# Altium schematic sheet POWER.SchDoc
size A3
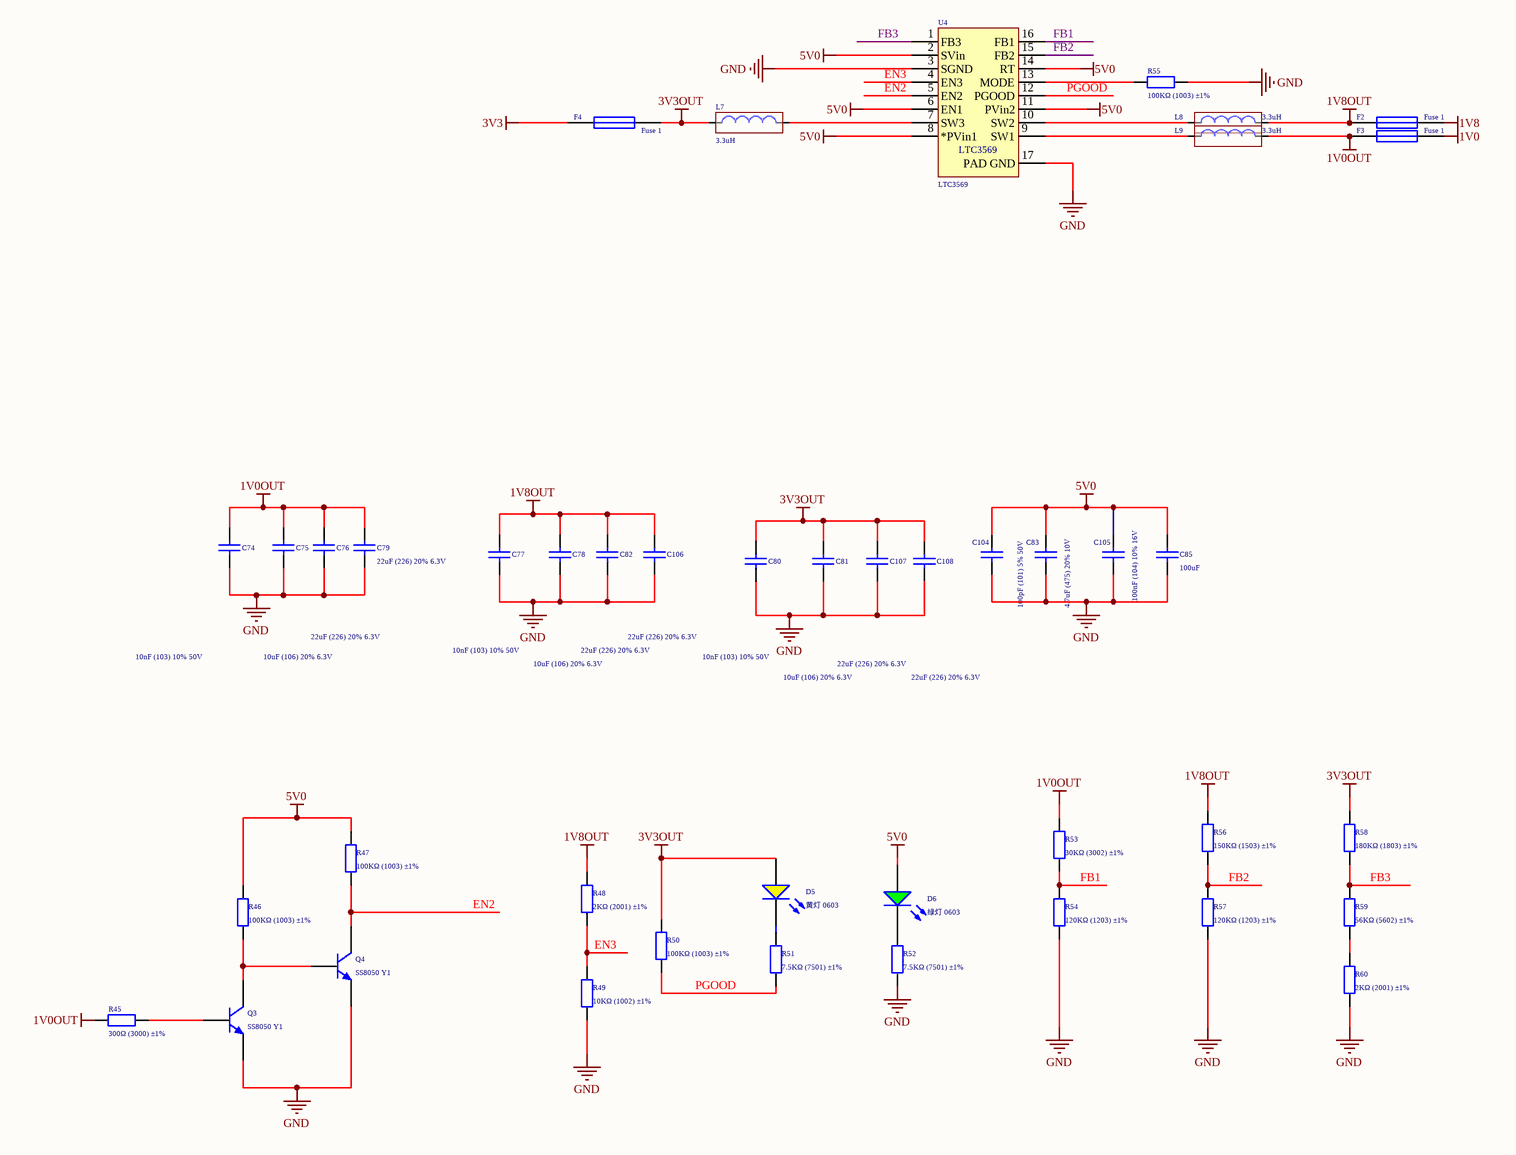
[diagram p0: POWER.SchDoc]

## Parts
C74  10nF (103) 10% 50V  [0402_C]
C75  10uF (106) 20% 6.3V  [0402_C]
C76  22uF (226) 20% 6.3V  [0603_C]
C77  10nF (103) 10% 50V  [0402_C]
C78  10uF (106) 20% 6.3V  [0402_C]
C79  22uF (226) 20% 6.3V  [0603_C]
C80  10nF (103) 10% 50V  [0402_C]
C81  10uF (106) 20% 6.3V  [0402_C]
C82  22uF (226) 20% 6.3V  [0603_C]
C83  4.7uF (475) 20% 10V  [0402_C]
C85  value 100uF  [LC-1206]  (hidden comment: Cap)
C104  100pF (101) 5% 50V  [0402_C]
C105  100nF (104) 10% 16V  [0402_C]
C106  22uF (226) 20% 6.3V  [0603_C]
C107  22uF (226) 20% 6.3V  [0603_C]
C108  22uF (226) 20% 6.3V  [0603_C]
D5  黄灯 0603  [0603_LED_S1]
D6  绿灯 0603  [0603_LED_S1]
F2  Fuse 1  [1206]
F3  Fuse 1  [1206]
F4  Fuse 1  [1206]
L7  3.3uH  [LC-1210]
L8  3.3uH  [LC-1210]
L9  3.3uH  [LC-1210]
Q3  SS8050 Y1  [SOT-23(SOT-23-3)]
Q4  SS8050 Y1  [SOT-23(SOT-23-3)]
R45  300Ω (3000) ±1%  [0402_R]
R46  100KΩ (1003) ±1%  [0402_R]
R47  100KΩ (1003) ±1%  [0402_R]
R48  2KΩ (2001) ±1%  [0402_R]
R49  10KΩ (1002) ±1%  [0402_R]
R50  100KΩ (1003) ±1%  [0402_R]
R51  7.5KΩ (7501) ±1%  [0402_R]
R52  7.5KΩ (7501) ±1%  [0402_R]
R53  30KΩ (3002) ±1%  [0603_R]
R54  120KΩ (1203) ±1%  [0402_R]
R55  100KΩ (1003) ±1%  [0402_R]
R56  150KΩ (1503) ±1%  [0402_R]
R57  120KΩ (1203) ±1%  [0402_R]
R58  180KΩ (1803) ±1%  [0603_R]
R59  56KΩ (5602) ±1%  [0402_R]
R60  2KΩ (2001) ±1%  [0402_R]
U4  LTC3569  [SOP127P600-16N]

## Nets
1V0: F3.1
1V0OUT: C74.2 C75.2 C76.2 C79.2 F3.2 L9.2 R45.1 R53.2
1V8: F2.1
1V8OUT: C77.2 C78.2 C82.2 C106.2 F2.2 L8.2 R48.2 R56.2
3V3: F4.2
3V3OUT: C80.2 C81.2 C107.2 C108.2 D5.A F4.1 L7.1 R50.2 R58.2
5V0: C83.1 C85.2 C104.2 C105.2 D6.A R46.2 R47.2 U4.2(SVin) U4.6(EN1) U4.8(*PVin1) U4.11(PVin2) U4.14(RT)
GND: C74.1 C75.1 C76.1 C77.1 C78.1 C79.1 C80.1 C81.1 C82.1 C83.2 C85.1 C104.1 C105.1 C106.1 C107.1 C108.1 Q3.2(E) Q4.2(E) R49.1 R52.1 R54.1 R55.2 R57.1 R60.1 U4.3(SGND) U4.17(PAD_GND)
EN2: Q4.3(C) R47.1 U4.5(EN2)
EN3: R48.1 R49.2 U4.4(EN3)
FB1: R53.1 R54.2 U4.16(FB1)
FB2: R56.1 R57.2 U4.15(FB2)
FB3: R58.1 R59.2 U4.1(FB3)
PGOOD: R50.1 R51.1 U4.12(PGOOD)
NetD5_K: D5.K R51.2
NetD6_K: D6.K R52.2
NetL7_2: L7.2 U4.7(SW3)
NetL8_1: L8.1 U4.10(SW2)
NetL9_1: L9.1 U4.9(SW1)
NetQ3_1: Q3.1(B) R45.2
NetQ3_3: Q3.3(C) Q4.1(B) R46.1
NetR55_1: R55.1 U4.13(MODE)
NetR59_1: R59.1 R60.2

## Library data of the parts
C74 C77 C80 = 0402 10nF (103) 10% 50V: 贴片电容; ComponentLink1Description: 供应商链接; ComponentLink1URL: http://www.szlcsc.com/product/details_15869.html; Package: 0402; Supplier: LC; SuppliersPartNumber: C15195
C75 C78 C81 = 0402 10uF (106) 20% 6.3V: 贴片电容; ComponentLink1Description: 供应商链接; ComponentLink1URL: http://www.szlcsc.com/product/details_16204.html; Package: 0402; Supplier: LC; SuppliersPartNumber: C15525
C76 C79 C82 C106-C108 = 0603 22uF (226) 20% 6.3V: 贴片电容; ComponentLink1Description: 供应商链接; ComponentLink1URL: http://www.szlcsc.com/product/details_60514.html; Package: 0603; Supplier: LC; SuppliersPartNumber: C59461
C83 = 0402 4.7uF (475) 20% 10V: 贴片电容; ComponentLink1Description: 供应商链接; ComponentLink1URL: http://www.szlcsc.com/product/details_24469.html; Package: 0402; Supplier: LC; SuppliersPartNumber: C23733
C85 = Cap: 贴片电容; Published: 8-Jun-2000; LatestRevisionDate: 17-Jul-2002; LatestRevisionNote: Re-released for DXP Platform.; PackageReference: RAD-0.3; Publisher: Altium Limited
C104 = 0402 100pF (101) 5% 50V: 贴片电容; ComponentLink1Description: 供应商链接; ComponentLink1URL: http://www.szlcsc.com/product/details_1898.html; Package: 0402; Supplier: LC; SuppliersPartNumber: C1546
C105 = 0402 100nF (104) 10% 16V: 贴片电容; ComponentLink1Description: 供应商链接; ComponentLink1URL: http://www.szlcsc.com/product/details_1877.html; Package: 0402; Supplier: LC; SuppliersPartNumber: C1525
D5 = 0603 黄灯: 发光二极管; ComponentLink1Description: 供应商链接; ComponentLink1URL: http://www.szlcsc.com/product/details_73147.html; Package: 0603; Supplier: LC; SuppliersPartNumber: C72038
D6 = 0603 绿灯: 发光二极管; ComponentLink1Description: 供应商链接; ComponentLink1URL: http://www.szlcsc.com/product/details_73152.html; Package: 0603; Supplier: LC; SuppliersPartNumber: C72043
F2-F4 = Fuse 1: Fuse; Published: 8-Jun-2000; LatestRevisionDate: 17-Jul-2002; LatestRevisionNote: Re-released for DXP Platform.; PackageReference: PIN-W2/E2.8; Publisher: Altium Limited; PackageDescription: Thru-Hole; 2 Leads
L7-L9 = Inductor_1: Inductor
Q3 Q4 = SOT-23 SS8050 Y1: 三极管; ComponentLink1Description: 供应商链接; ComponentLink1URL: http://www.szlcsc.com/product/details_2507.html; Package: SOT-23; Supplier: LC; SuppliersPartNumber: C2150
R45 = 0402 300Ω (3000) 1%: 贴片电阻; ComponentLink1Description: 供应商链接; ComponentLink1URL: http://www.szlcsc.com/product/details_25845.html; Package: 0402; Supplier: LC; SuppliersPartNumber: C25102
R46 R47 R50 R55 = 0402 100KΩ (1003) 1%: 贴片电阻; ComponentLink1Description: 供应商链接; ComponentLink1URL: http://www.szlcsc.com/product/details_26484.html; Package: 0402; Supplier: LC; SuppliersPartNumber: C25741
R48 R60 = 0402 2KΩ (2001) 1%: 贴片电阻; ComponentLink1Description: 供应商链接; ComponentLink1URL: http://www.szlcsc.com/product/details_4516.html; Package: 0402; Supplier: LC; SuppliersPartNumber: C4109
R49 = 0402 10KΩ (1002) 1%: 贴片电阻; ComponentLink1Description: 供应商链接; ComponentLink1URL: http://www.szlcsc.com/product/details_26487.html; Package: 0402; Supplier: LC; SuppliersPartNumber: C25744
R51 R52 = 0402 7.5KΩ (7501) 1%: 贴片电阻; ComponentLink1Description: 供应商链接; ComponentLink1URL: http://www.szlcsc.com/product/details_26661.html; Package: 0402; Supplier: LC; SuppliersPartNumber: C25918
R53 = 0603 30KΩ (3002) 1%: 贴片电阻; ComponentLink1Description: 供应商链接; ComponentLink1URL: http://www.szlcsc.com/product/details_23711.html; Package: 0603; Supplier: LC; SuppliersPartNumber: C22984
R54 R57 = 0402 120KΩ (1203) 1%: 贴片电阻; ComponentLink1Description: 供应商链接; ComponentLink1URL: http://www.szlcsc.com/product/details_26493.html; Package: 0402; Supplier: LC; SuppliersPartNumber: C25750
R56 = 0402 150KΩ (1503) 1%: 贴片电阻; ComponentLink1Description: 供应商链接; ComponentLink1URL: http://www.szlcsc.com/product/details_26498.html; Package: 0402; Supplier: LC; SuppliersPartNumber: C25755
R58 = 0603 180KΩ (1803) 1%: 贴片电阻; ComponentLink1Description: 供应商链接; ComponentLink1URL: http://www.szlcsc.com/product/details_23554.html; Package: 0603; Supplier: LC; SuppliersPartNumber: C22827
R59 = 0402 56KΩ (5602) 1%: 贴片电阻; ComponentLink1Description: 供应商链接; ComponentLink1URL: http://www.szlcsc.com/product/details_26539.html; Package: 0402; Supplier: LC; SuppliersPartNumber: C25796